# EAGLE schematic shield (EAGLE 8.1.1)
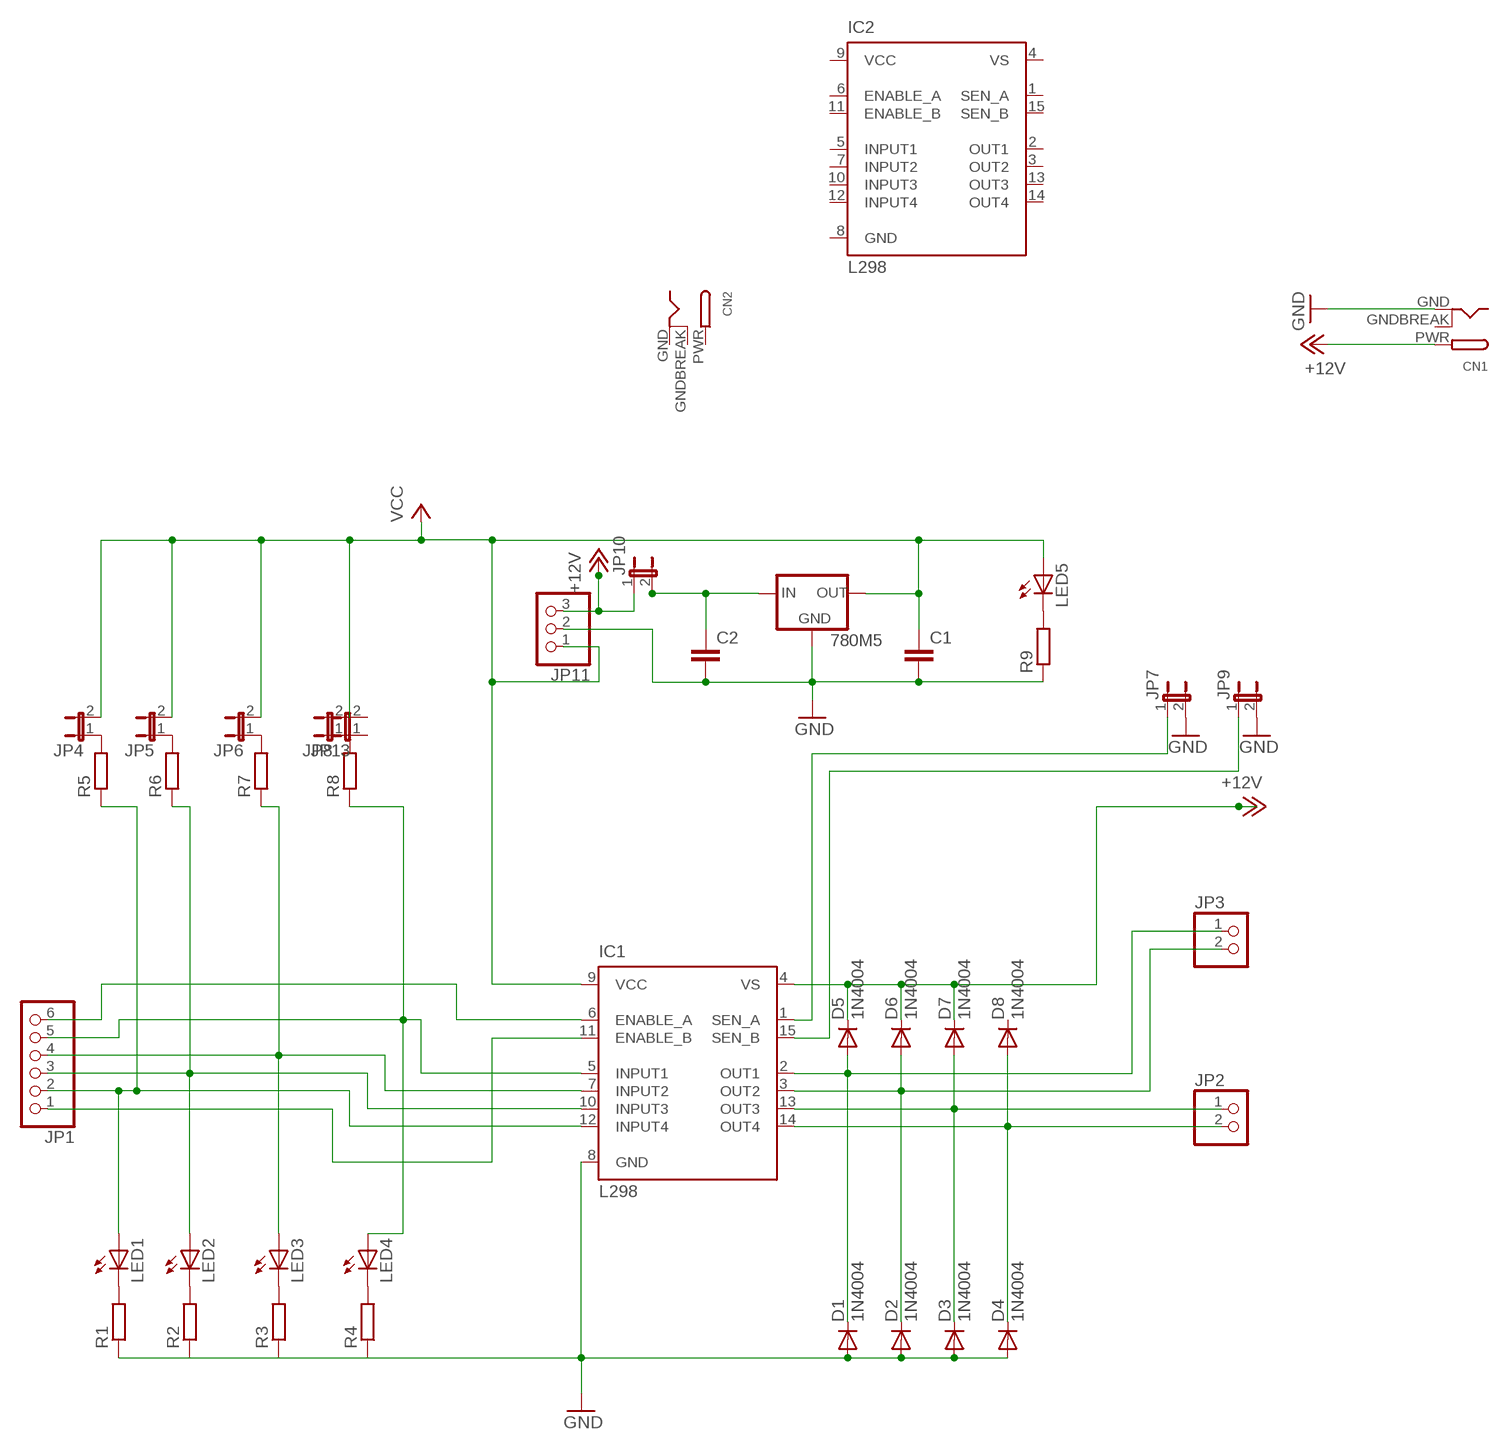
[diagram p0: schematic, sheet 1]

## Parts
780M5  78XXS  [78XXS]
C1  C-EU025-025X050  [C025-025X050]
C2  C-EU025-025X050  [C025-025X050]
CN1  DCBARRELPTH  [DCJACK_2MM_PTH]
CN2  DCBARRELPTH  [DCJACK_2MM_PTH]
D1  1N4004  [DO41-10]
D2  1N4004  [DO41-10]
D3  1N4004  [DO41-10]
D4  1N4004  [DO41-10]
D5  1N4004  [DO41-10]
D6  1N4004  [DO41-10]
D7  1N4004  [DO41-10]
D8  1N4004  [DO41-10]
IC1  L298  [MULTIWATT-15]
IC2  L298  [MULTIWATT-15]
JP1  PINHD-1X6  [1X06]
JP2  PINHD-1X2  [1X02]
JP3  PINHD-1X2  [1X02]
JP4  JP1E  [JP1]
JP5  JP1E  [JP1]
JP6  JP1E  [JP1]
JP7  JP1E  [JP1]
JP8  JP1E  [JP1]
JP9  JP1E  [JP1]
JP10  JP1E  [JP1]
JP11  PINHD-1X3  [1X03]
JP13  JP1E  [JP1]
LED1  LED5MM  [LED5MM]
LED2  LED5MM  [LED5MM]
LED3  LED5MM  [LED5MM]
LED4  LED5MM  [LED5MM]
LED5  LED5MM  [LED5MM]
R1  R-EU_0207/7  [0207/7]
R2  R-EU_0207/7  [0207/7]
R3  R-EU_0207/7  [0207/7]
R4  R-EU_0207/7  [0207/7]
R5  R-EU_0207/7  [0207/7]
R6  R-EU_0207/7  [0207/7]
R7  R-EU_0207/7  [0207/7]
R8  R-EU_0207/7  [0207/7]
R9  R-EU_0207/10  [0207/10]

## Nets
+12V: D5.C D6.C D7.C IC1.4(VS) JP10.1 JP11.3
GND: 780M5.GND C1.2 C2.2 CN1.GND D1.A D2.A D3.A D4.A IC1.8(GND) JP7.2 JP9.2 JP11.2 R1.1 R9.1
N$1: IC1.6(ENABLE_A) JP1.6
N$2: IC1.5(INPUT1) JP1.5 LED4.A R8.1
N$3: IC1.7(INPUT2) JP1.4 LED3.A R7.1
N$4: IC1.10(INPUT3) JP1.3 LED2.A R6.1
N$5: IC1.12(INPUT4) JP1.2 LED1.A R5.1
N$6: IC1.11(ENABLE_B) JP1.1
N$7: LED1.K(C) R1.2
N$8: LED2.K(C) R2.2
N$9: LED3.K(C) R3.2
N$10: LED4.K(C) R4.2
N$11: D4.C D8.A IC1.14(OUT4) JP2.2
N$12: D3.C D7.A IC1.13(OUT3) JP2.1
N$13: D2.C D6.A IC1.3(OUT2) JP3.2
N$14: D1.C D5.A IC1.2(OUT1) JP3.1
N$15: JP4.1 R5.2
N$16: JP5.1 R6.2
N$17: JP6.1 R7.2
N$18: JP8.1 R8.2
N$19: IC1.1(SEN_A) JP7.1
N$20: IC1.15(SEN_B) JP9.1
N$22: LED5.K(C) R9.2
N$23: 780M5.IN C2.1 JP10.2
N$24: CN1.PWR
VCC: 780M5.OUT C1.1 IC1.9(VCC) JP4.2 JP5.2 JP6.2 JP8.2 JP11.1 LED5.A
Unconnected: D8.C IC2.1(SEN_A) IC2.2(OUT1) IC2.3(OUT2) IC2.5(INPUT1) IC2.6(ENABLE_A) IC2.7(INPUT2) IC2.10(INPUT3) IC2.11(ENABLE_B) IC2.12(INPUT4) IC2.13(OUT3) IC2.14(OUT4) IC2.15(SEN_B) JP13.1 JP13.2 R2.1 R3.1 R4.1

## Power pins joined to a net without a drawn wire
GND: CN2.GND IC2.8(GND)
GNDBREAK: CN1.GNDBREAK CN2.GNDBREAK
PWR: CN2.PWR
VCC: IC2.9(VCC)
VS: IC2.4(VS)

## Library data of the parts
780M5 = v-reg:78XXS: VOLTAGE REGULATOR
C1 C2 = rcl:C-EU: CAPACITOR, European symbol
CN1 CN2 = adafruit:DCBARREL: 2.0mm DC Barrel Jack DCJACK_2MM_PTH - Through Hole Jack (4UConnector: 05537)
D1-D8 = adafruit:1N4004: DIODE General purpose 1N400x type rectifier (With bigger pads) http://www.ladyada.net/library/pcb/eaglelibrary.html
IC1 IC2 = st-microelectronics:L298: DUAL FULL-BRIDGE DRIVER; MPN: L298N; OC_FARNELL: 1589425; OC_NEWARK: 32M1527
JP1 = adafruit:PINHD-1X6: PIN HEADER
JP2 JP3 = pinhead:PINHD-1X2: PIN HEADER
JP4-JP10 JP13 = jumper:JP1E: JUMPER
JP11 = pinhead:PINHD-1X3: PIN HEADER
LED1-LED5 = adafruit:LED: LED OSRAM: - CHIPLED LG R971, LG N971, LY N971, LG Q971, LY Q971, LO R971, LY R971 LH N974, LH R974 LS Q976, LO Q976, LY Q976 LO Q996 - Hyper CHIPLED LW Q18S LB Q993, LB Q99A, LB R99A - SideLED LS A670, LO A670, LY A670, LG A670, LP A670 LB A673, LV A673, LT A673, LW A673 LH A674 LY A675 LS A676, LA A676, LO A676, LY A676, LW A676 LS A679, LY A679, LG A679 - Hyper Micro SIDELED® LS Y876, LA Y876, LO Y876, LY Y876 LT Y87S - SmartLED LW L88C, LW L88S LB L89C, LB L89S, LG L890 LS L89K, LO L89K, LY L89K LS L896, LA L896, LO L896, LY L896 - TOPLED LS T670, LO T670, LY T670, LG T670, LP T670 LSG T670, LSP T670, LSY T670, LOP T670, LYG T670 LG T671, LOG T671, LSG T671 LB T673, LV T673, LT T673, LW T673 LH T674 LS T676, LA T676, LO T676, LY T676, LB T676, LH T676, LSB T676, LW T676 LB T67C, LV T67C, LT T67C, LS T67K, LO T67K, LY T67K, LW E67C LS E67B, LA E67B, LO E67B, LY E67B, LB E67C, LV E67C, LT E67C LW T67C LS T679, LY T679, LG T679 LS T770, LO T770, LY T770, LG T770, LP T770 LB T773, LV T773, LT T773, LW T773 LH T774 LS E675, LA E675, LY E675, LS T675 LS T776, LA T776, LO T776, LY T776, LB T776 LHGB T686 LT T68C, LB T68C - Hyper Mini TOPLED® LB M676 - Mini TOPLED Santana® LG M470 LS M47K, LO M47K, LY M47K Source: http://www.osram.convergy.de/
R1-R9 = resistor:R-EU_: RESISTOR, European symbol